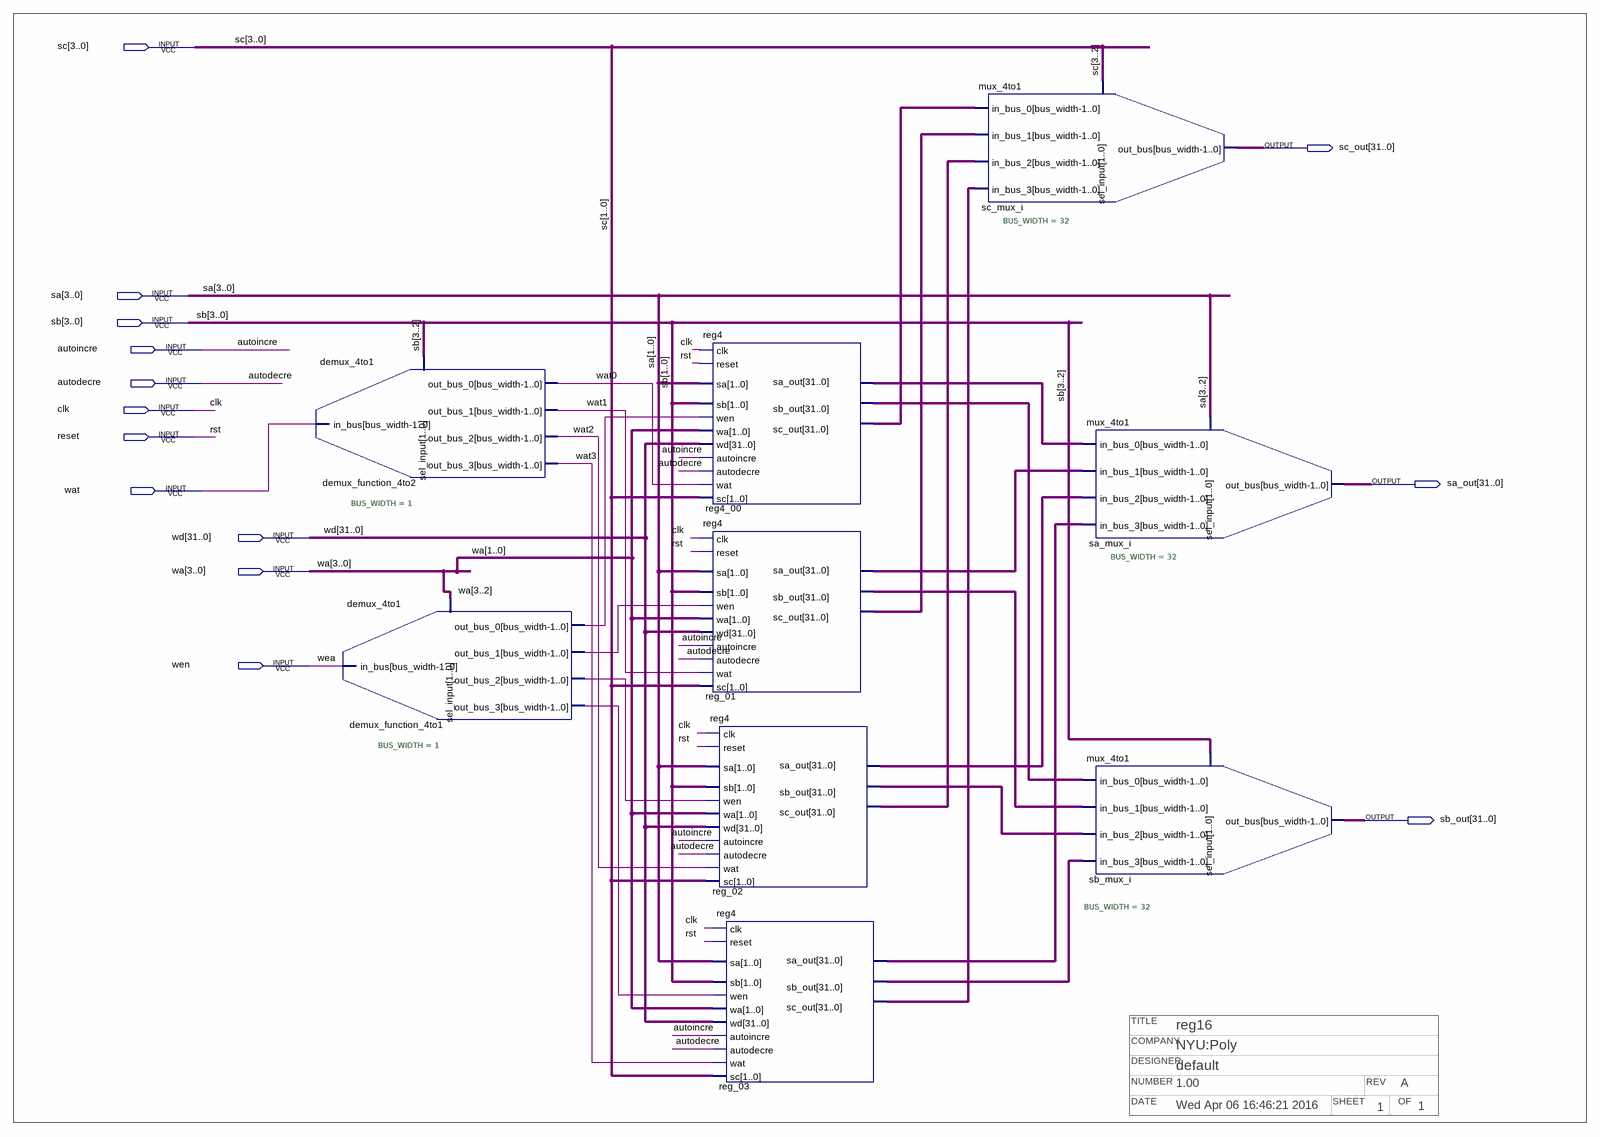
[diagram p0: schematic sheet]
// Quartus schematic reg16.bdf as structural Verilog: 9 symbols, 14 pins
// Title block: COMPANY: NYU:Poly; DATE: Wed Apr 06 16:46:21 2016; DESIGNER: default; NUMBER: 1.00; OF: 1; REV: A; SHEET: 1; TITLE: reg16
module reg16 (
  input  [3:0] sc,
  input  [3:0] sa,
  input  [3:0] sb,
  input  autoincre,
  input  autodecre,
  input  clk,
  input  reset,
  input  wat,
  input  [31:0] wd,
  input  [3:0] wa,
  input  wen,
  output [31:0] sc_out,
  output [31:0] sa_out,
  output [31:0] sb_out
);

  wire demux_function_4to1_out_bus_0, demux_function_4to1_out_bus_1, demux_function_4to1_out_bus_2,
       demux_function_4to1_out_bus_3, wat0, wat1, wat2, wat3;
  wire [31:0] reg4_00_sb_out, reg4_00_sc_out, reg_01_sa_out, reg_01_sb_out, reg_01_sc_out, reg_02_sa_out,
       reg_02_sb_out, reg_02_sc_out, reg_03_sa_out, reg_03_sb_out, reg_03_sc_out, sa_out_a;

  demux_4to1 #(.BUS_WIDTH(1)) demux_function_4to2 (
    .sel_input(sb[3:2]), .in_bus(wat), .out_bus_0(wat0), .out_bus_1(wat1), .out_bus_2(wat2), .out_bus_3(wat3));
  demux_4to1 #(.BUS_WIDTH(1)) demux_function_4to1 (
    .sel_input(wa[3:2]), .in_bus(wen), .out_bus_0(demux_function_4to1_out_bus_0),
    .out_bus_1(demux_function_4to1_out_bus_1), .out_bus_2(demux_function_4to1_out_bus_2),
    .out_bus_3(demux_function_4to1_out_bus_3));
  reg4 reg4_00 (
    .wat(wat0), .autoincre(autoincre), .autodecre(autodecre), .wd(wd), .wa(wa[1:0]),
    .wen(demux_function_4to1_out_bus_0), .sa(sa[1:0]), .clk(clk), .reset(reset), .sb(sb[1:0]), .sc(sc[1:0]),
    .sa_out(sa_out_a), .sb_out(reg4_00_sb_out), .sc_out(reg4_00_sc_out));
  reg4 reg_01 (
    .wat(wat1), .autoincre(autoincre), .autodecre(autodecre), .wd(wd), .wa(wa[1:0]),
    .wen(demux_function_4to1_out_bus_1), .sa(sa[1:0]), .clk(clk), .reset(reset), .sb(sb[1:0]), .sc(sc[1:0]),
    .sa_out(reg_01_sa_out), .sb_out(reg_01_sb_out), .sc_out(reg_01_sc_out));
  reg4 reg_02 (
    .wat(wat2), .autoincre(autoincre), .autodecre(autodecre), .wd(wd), .wa(wa[1:0]),
    .wen(demux_function_4to1_out_bus_2), .sa(sa[1:0]), .clk(clk), .reset(reset), .sb(sb[1:0]), .sc(sc[1:0]),
    .sa_out(reg_02_sa_out), .sb_out(reg_02_sb_out), .sc_out(reg_02_sc_out));
  reg4 reg_03 (
    .wat(wat3), .autoincre(autoincre), .autodecre(autodecre), .wd(wd), .wa(wa[1:0]),
    .wen(demux_function_4to1_out_bus_3), .sa(sa[1:0]), .clk(clk), .reset(reset), .sb(sb[1:0]), .sc(sc[1:0]),
    .sa_out(reg_03_sa_out), .sb_out(reg_03_sb_out), .sc_out(reg_03_sc_out));
  mux_4to1 #(.BUS_WIDTH(32)) sc_mux_i (
    .sel_input(sc[3:2]), .in_bus_0(reg4_00_sc_out), .in_bus_1(reg_01_sc_out), .in_bus_2(reg_02_sc_out),
    .in_bus_3(reg_03_sc_out), .out_bus(sc_out));
  mux_4to1 #(.BUS_WIDTH(32)) sa_mux_i (
    .sel_input(sa[3:2]), .in_bus_0(sa_out_a), .in_bus_1(reg_01_sa_out), .in_bus_2(reg_02_sa_out),
    .in_bus_3(reg_03_sa_out), .out_bus(sa_out));
  mux_4to1 #(.BUS_WIDTH(32)) sb_mux_i (
    .sel_input(sb[3:2]), .in_bus_0(reg4_00_sb_out), .in_bus_1(reg_01_sb_out), .in_bus_2(reg_02_sb_out),
    .in_bus_3(reg_03_sb_out), .out_bus(sb_out));

  // Other names for the same wires on the sheet: rst = reset; wea = wen
endmodule
